# Altium schematic sheet OLED0.96.SchDoc
size A4
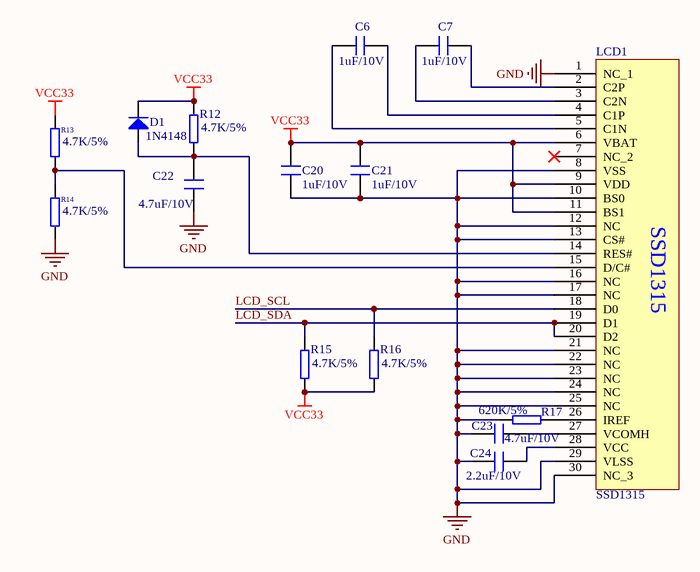
[diagram p0: OLED0.96.SchDoc]

## Parts
C6  1uF/10V  [0603R]
C7  1uF/10V  [0603R]
C20  1uF/10V  [0603R]
C21  1uF/10V  [0603R]
C22  4.7uF/10V  [0603R]
C23  4.7uF/10V  [0603R]
C24  2.2uF/10V  [0603R]
D1  1N4148  [1206D]
LCD1  SSD1315  [OLED0.96 丝印]
R12  4.7K/5%  [0603R]
R13  4.7K/5%  [0603R]
R14  4.7K/5%  [0603R]
R15  4.7K/5%  [0603R]
R16  4.7K/5%  [0603R]
R17  620K/5%  [0603R]

## Nets
GND: C20.1 C21.1 C22.1 C23.2 C24.2 LCD1.1(NC_1) LCD1.8(VSS) LCD1.10(BS0) LCD1.12(NC) LCD1.13(CS#) LCD1.16(NC) LCD1.17(NC) LCD1.21(NC) LCD1.22(NC) LCD1.23(NC) LCD1.24(NC) LCD1.25(NC) LCD1.29(VLSS) LCD1.30(NC_3) R14.2 R17.1
VCC33: C20.2 C21.2 D1.1(K) LCD1.6(VBAT) LCD1.9(VDD) LCD1.11(BS1) R12.1 R13.1 R15.2 R16.2
LCD_SCL: LCD1.18(D0) R16.1
LCD_SDA: LCD1.19(D1) LCD1.20(D2) R15.1
NetC6_1: C6.1 LCD1.5(C1N)
NetC6_2: C6.2 LCD1.4(C1P)
NetC7_1: C7.1 LCD1.3(C2N)
NetC7_2: C7.2 LCD1.2(C2P)
NetC22_2: C22.2 D1.2(A) LCD1.14(RES#) R12.2
NetC23_1: C23.1 LCD1.27(VCOMH)
NetC24_1: C24.1 LCD1.28(VCC)
NetLCD1_15: LCD1.15(D/C#) R13.2 R14.1
NetLCD1_26: LCD1.26(IREF) R17.2

Not connected (* = marked no-connect by the designer): LCD1 7(NC_2)*

## Library data of the parts
C6 C7 C20-C24 = CAP
D1 = DIODE
R12-R17 = RES